# Altium schematic sheet FX_HT32.SchDoc
size A3
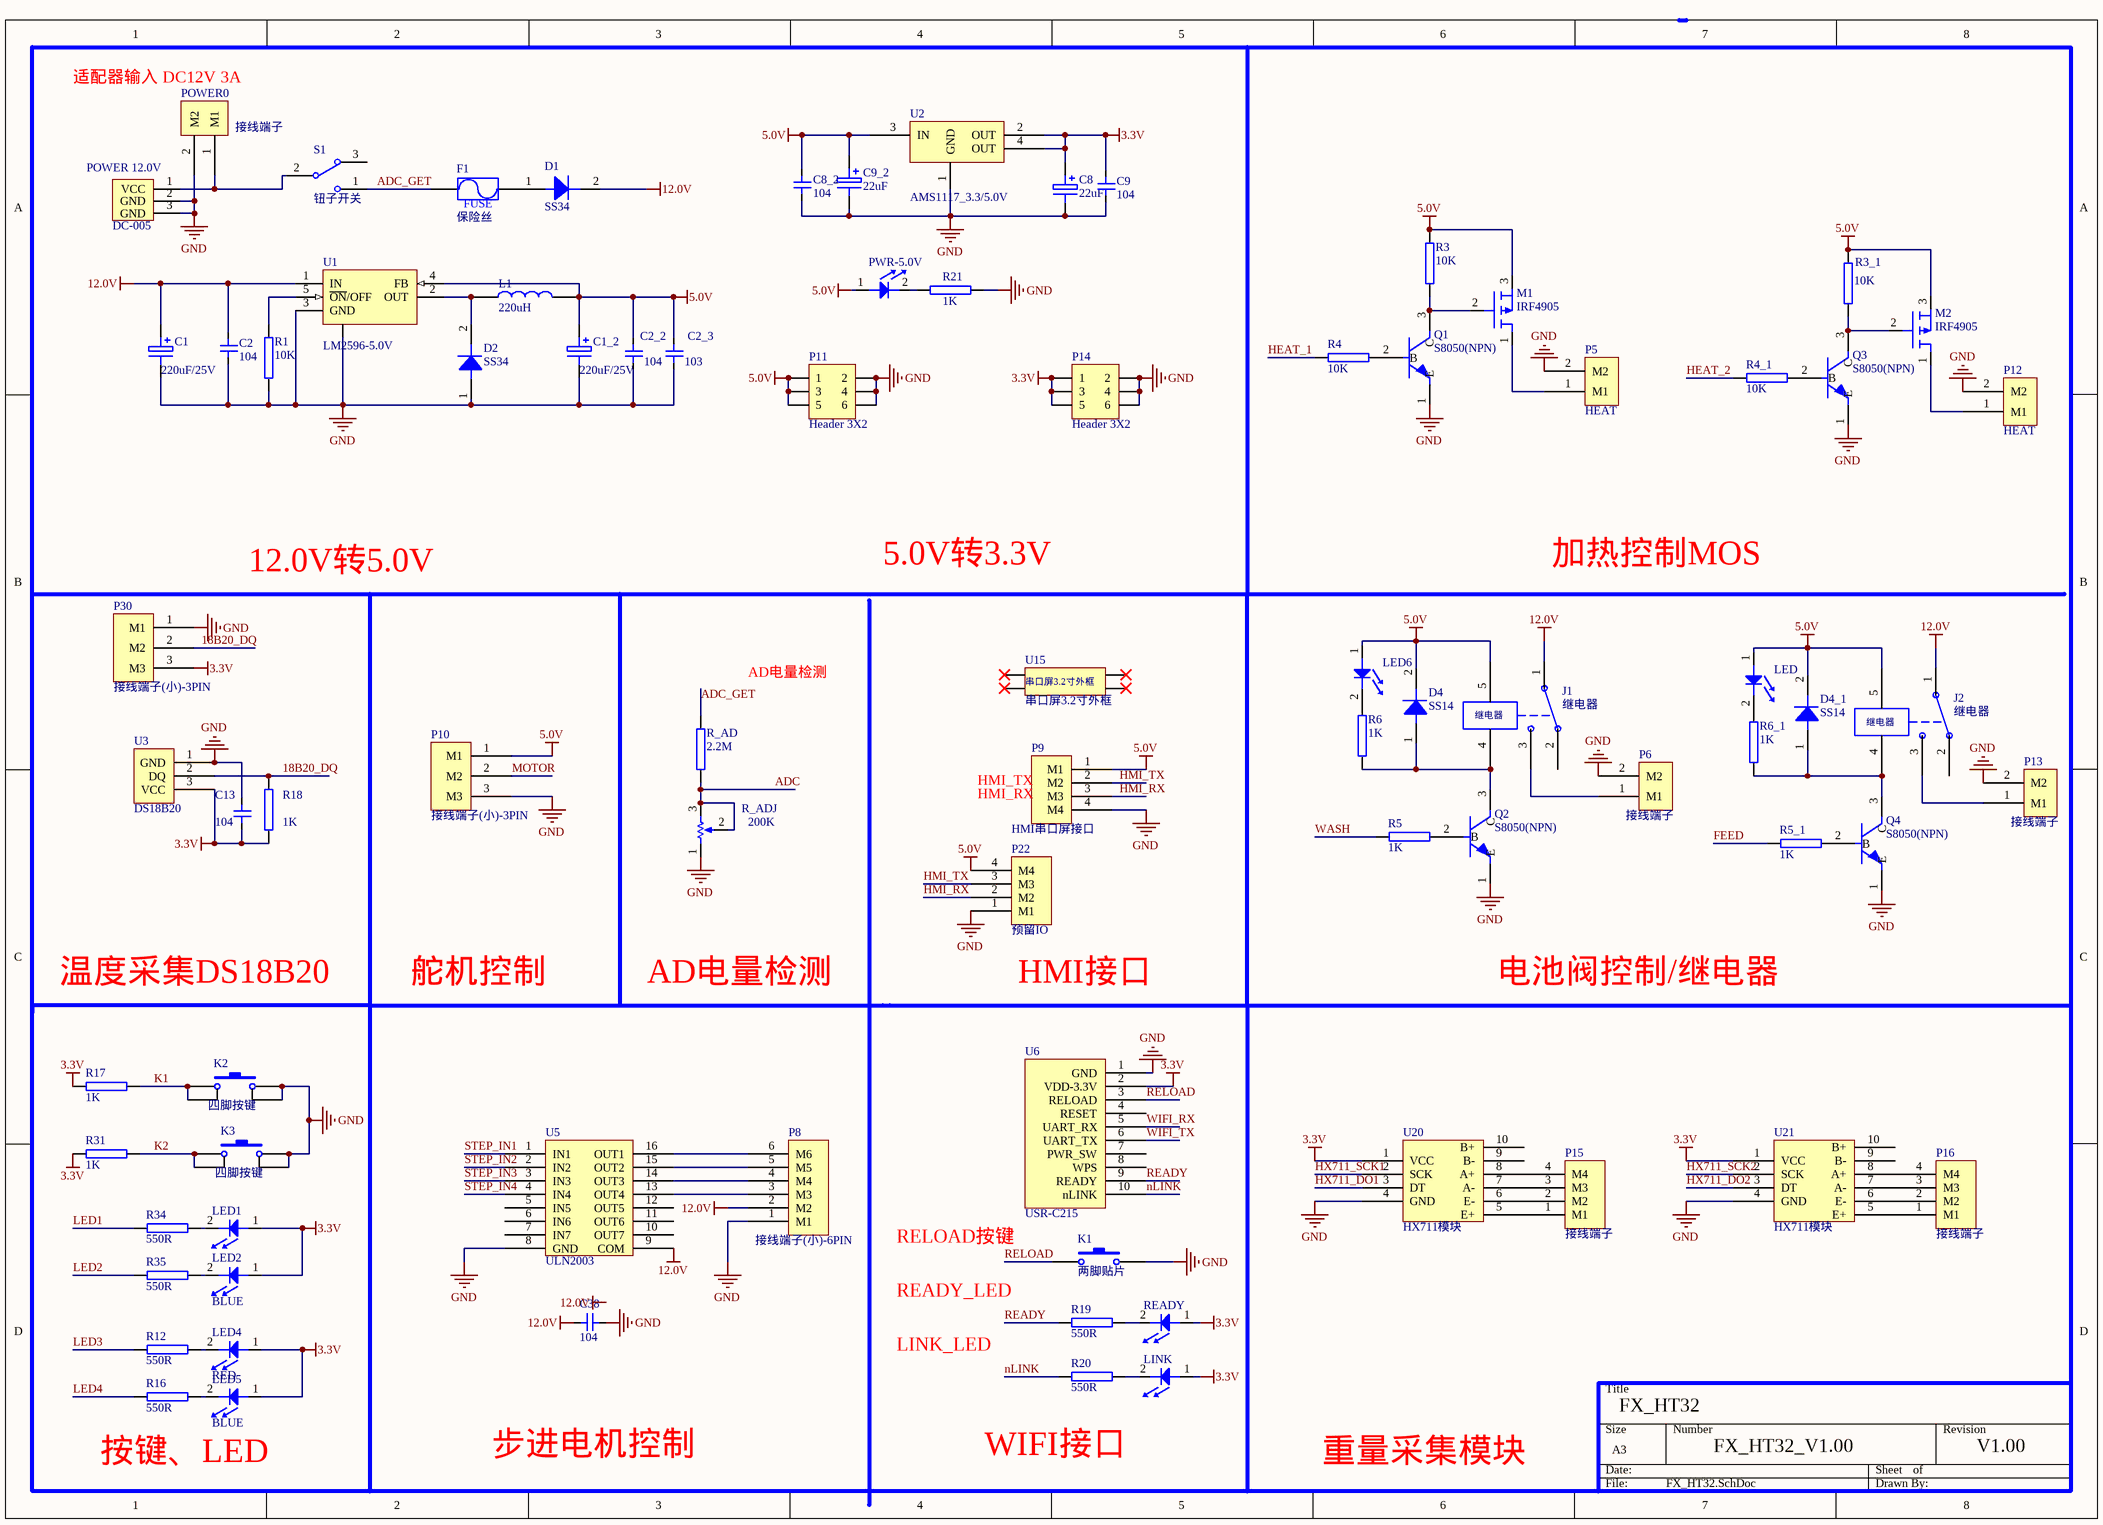
[diagram p0: FX_HT32.SchDoc]

## Parts
C1  220uF/25V  [Cap1(100uF)]
C1_2  220uF/25V  [Cap1(100uF)]
C2  104  [0805C]
C2_2  104  [0805C]
C2_3  103  [0805C]
C8  22uF  [Cap122uF)]
C8_2  104  [0805C]
C9  104  [0805C]
C9_2  22uF  [Cap122uF)]
C13  104  [0805C]
C38  104  [0805C]
D1  SS34  [SS14]
D2  SS34  [SS14]
D4  SS14  [SS14]
D4_1  SS14  [SS14]
F1  保险丝  [1812]
J1  继电器  [继电器]
J2  继电器  [继电器]
K1  两脚贴片  [贴片按键]
K2  四脚按键  [SW_PB4_DIP]
K3  四脚按键  [SW_PB4_DIP]
L1  220uH  [电感 220uh]
LED  (no value)  [0805LED]
LED1  (no value)  [0805LED]
LED2  BLUE  [0805LED]
LED4  RED  [0805LED]
LED5  BLUE  [0805LED]
LED6  (no value)  [0805LED]
LINK  (no value)  [0805LED]
M1  IRF4905  [IRF4905]
M2  IRF4905  [IRF4905]
P5  HEAT  [HEAT]
P6  接线端子  [接线端子(小)-2PIN]
P8  接线端子(小)-6PIN  [接线端子(小)-6PIN]
P9  HMI串口屏接口  [接线端子(小)-4PIN]
P10  接线端子(小)-3PIN  [接线端子(小)-3PIN]
P11  Header 3X2  [Header 3X2]
P12  HEAT  [HEAT]
P13  接线端子  [接线端子(小)-2PIN]
P14  Header 3X2  [Header 3X2]
P15  接线端子  [接线端子(小)-4PIN]
P16  接线端子  [接线端子(小)-4PIN]
P22  预留IO  [接线端子(小)-4PIN]
P30  接线端子(小)-3PIN  [接线端子(小)-3PIN]
POWER0  接线端子  [HEAT]
POWER_12.0V  DC-005  [DC-005]
PWR-5.0V  (no value)  [0805LED]
Q1  S8050(NPN)  [NPN]
Q2  S8050(NPN)  [NPN]
Q3  S8050(NPN)  [NPN]
Q4  S8050(NPN)  [NPN]
R1  10K  [0805R]
R3  10K  [0805R]
R3_1  10K  [0805R]
R4  10K  [0805R]
R4_1  10K  [0805R]
R5  1K  [0805R]
R5_1  1K  [0805R]
R6  1K  [0805R]
R6_1  1K  [0805R]
R12  550R  [0805R]
R16  550R  [0805R]
R17  1K  [0805R]
R18  1K  [0805R]
R19  550R  [0805R]
R20  550R  [0805R]
R21  1K  [0805R]
R31  1K  [0805R]
R34  550R  [0805R]
R35  550R  [0805R]
R_AD  2.2M  [0805R]
R_ADJ  200K  [电位器]
READY  (no value)  [0805LED]
S1  钮子开关  [钮子开关(大)]
U1  LM2596-5.0V  [TO-263-5]
U2  AMS1117_3.3/5.0V  [SOT-223]
U3  DS18B20  [DS18B20]
U5  ULN2003  [ULN2003]
U6  USR-C215  [USR-C215]
U15  串口屏3.2寸外框  [串口屏 3.2寸]
U20  HX711模块  [HX711模块]
U21  HX711模块  [HX711模块]

## Nets
3.3V: C8.1 C9.2 C13.1 LED1.1 LED2.1 LED4.1 LED5.1 LINK.1 P14.1 P14.3 P14.5 P30.3(M3) R17.1 R18.2 R31.1 READY.1 U2.2(OUT) U2.4(OUT) U3.3(VCC) U6.2(VDD-3.3V) U20.1(VCC) U21.1(VCC)
5.0V: C1_2.1 C2_2.2 C2_3.2 C8_2.2 C9_2.1 D4.2 D4_1.2 J1.5 J2.5 L1.2 LED.1 LED6.1 M1.3 M2.3 P9.1(M1) P10.1(M1) P11.1 P11.3 P11.5 P22.4(M4) PWR-5.0V.1 R3.2 R3_1.2 U1.4(FB) U2.3(IN)
12.0V: C1.1 C2.2 C38.2 D1.2 J1.1 J2.1 P8.2(M2) U1.1(IN) U5.9(COM)
GND: C1.2 C1_2.2 C2.1 C2_2.1 C2_3.1 C8.2 C8_2.1 C9.1 C9_2.2 C13.2 C38.1 D2.1 K1.2 K2.2 K2.3 K3.2 K3.3 P5.2(M2) P6.2(M2) P8.1(M1) P9.4(M4) P10.3(M3) P11.2 P11.4 P11.6 P12.2(M2) P13.2(M2) P14.2 P14.4 P14.6 P22.1(M1) P30.1(M1) POWER0.2(M2) POWER_12.0V.2(GND) POWER_12.0V.3(GND) Q1.1(E) Q2.1(E) Q3.1(E) Q4.1(E) R1.1 R21.2 R_ADJ.1(TOP) U1.3(GND) U1.6 U2.1(GND) U3.1(GND) U5.8(GND) U6.1(GND) U20.4(GND) U21.4(GND)
18B20_DQ: P30.2(M2) R18.1 U3.2(DQ)
ADC: R_AD.2 R_ADJ.2(TAP) R_ADJ.3(BOT)
ADC_GET: F1.1 R_AD.1 S1.1
FEED: R5_1.1
HEAT_1: R4.1
HEAT_2: R4_1.1
HMI_RX: P9.3(M3) P22.2(M2)
HMI_TX: P9.2(M2) P22.3(M3)
HX711_DO1: U20.3(DT)
HX711_DO2: U21.3(DT)
HX711_SCK1: U20.2(SCK)
HX711_SCK2: U21.2(SCK)
K1: K2.1 K2.4 R17.2
K2: K3.1 K3.4 R31.2
LED1: R34.1
LED2: R35.1
LED3: R12.1
LED4: R16.1
MOTOR: P10.2(M2)
nLINK: R20.1 U6.10(nLINK)
READY: R19.1 U6.9(READY)
RELOAD: K1.1 U6.3(RELOAD)
STEP_IN1: U5.1(IN1)
STEP_IN2: U5.2(IN2)
STEP_IN3: U5.3(IN3)
STEP_IN4: U5.4(IN4)
WASH: R5.1
WIFI_RX: U6.5(UART_RX)
WIFI_TX: U6.6(UART_TX)
NetD1_1: D1.1 F1.2
NetD2_2: D2.2 L1.1 U1.2(OUT)
NetD4_1: D4.1 J1.4 Q2.3(C) R6.2
NetD4_1_1: D4_1.1 J2.4 Q4.3(C) R6_1.2
NetJ1_3: J1.3 P6.1(M1)
NetJ2_3: J2.3 P13.1(M1)
NetLED1_2: LED1.2 R34.2
NetLED2_2: LED2.2 R35.2
NetLED4_2: LED4.2 R12.2
NetLED5_2: LED5.2 R16.2
NetLED6_2: LED6.2 R6.1
NetLED_2: LED.2 R6_1.1
NetLINK_2: LINK.2 R20.2
NetM1_1: M1.1 P5.1(M1)
NetM1_2: M1.2 Q1.3(C) R3.1
NetM2_1: M2.1 P12.1(M1)
NetM2_2: M2.2 Q3.3(C) R3_1.1
NetP8_3: P8.3(M3) U5.13(OUT4)
NetP8_4: P8.4(M4) U5.14(OUT3)
NetP8_5: P8.5(M5) U5.15(OUT2)
NetP8_6: P8.6(M6) U5.16(OUT1)
NetP15_1: P15.1(M1) U20.5(E+)
NetP15_2: P15.2(M2) U20.6(E-)
NetP15_3: P15.3(M3) U20.7(A-)
NetP15_4: P15.4(M4) U20.8(A+)
NetP16_1: P16.1(M1) U21.5(E+)
NetP16_2: P16.2(M2) U21.6(E-)
NetP16_3: P16.3(M3) U21.7(A-)
NetP16_4: P16.4(M4) U21.8(A+)
NetPOWER0_1: POWER0.1(M1) POWER_12.0V.1(VCC) S1.2
NetPWR-5.0V_2: PWR-5.0V.2 R21.1
NetQ1_2: Q1.2(B) R4.2
NetQ2_2: Q2.2(B) R5.2
NetQ3_2: Q3.2(B) R4_1.2
NetQ4_2: Q4.2(B) R5_1.2
NetR1_2: R1.2 U1.5(~{ON}/OFF)
NetR19_2: R19.2 READY.2

Not connected (* = marked no-connect by the designer): J1 2; J2 2; S1 3; U5 5(IN5) 6(IN6) 7(IN7) 10(OUT7) 11(OUT6) 12(OUT5); U6 4(RESET) 7(PWR_SW) 8(WPS); U15 0*; U20 9(B-) 10(B+); U21 9(B-) 10(B+)

## Notes on the sheet
- (near POWER0) 适配器输入 DC12V 3A
- 12.0V转5.0V
- 5.0V转3.3V
- 加热控制MOS
- AD电量检测
- HMI_RX
- (near P9) HMI_TX
- 温度采集DS18B20
- 舵机控制
- (near P22) HMI接口
- 电池阀控制/继电器
- RELOAD按键
- READY_LED
- LINK_LED
- FX_HT32
- 按键、LED
- 步进电机控制
- (near R20) WIFI接口
- 重量采集模块
- FX_HT32_V1.00
- V1.00
- Labels drawn without touching a wire or pin: 12.0V
- (in symbol F1) FUSE

## Library data of the parts
C1 C1_2 C8 C9_2 = Cap1(100uF)
C2 C2_2 C2_3 C8_2 C9 C13 C38 = C1
D1 D2 = SS14
F1 = F1
K1 = Key(两脚贴片)
K2 K3 = Key(四脚)
L1 = L1
LED LED1 LED2 LED4-LED6 LINK PWR-5.0V READY = LED
P5 P6 P12 P13 POWER0 = 接线端子(小)-2PIN
P9 P15 P16 P22 = 接线端子(小)-4PIN
Q1-Q4 = Q2
R1 R3 R3_1 R4 R4_1 R5 R5_1 R6 R6_1 R12 R16-R21 R31 R34 R35 R_AD = R1
R_ADJ = RPot
U1 = LM2596
U2 = AMS1117-3.3V/5.0V
U15 = 串口屏3.2寸